# Altium schematic sheet [1.1]MOC_Channel.SchDoc
size A4
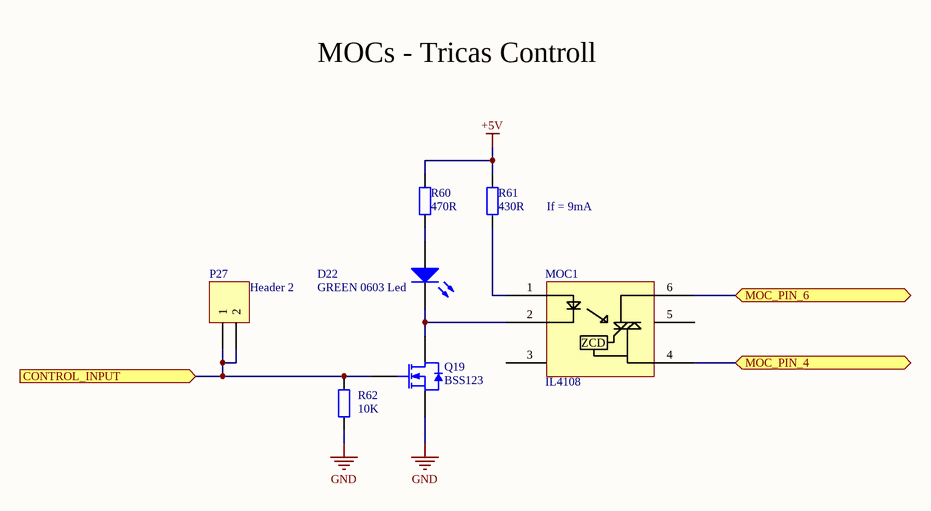
[diagram p0: [1.1]MOC_Channel.SchDoc]

## Parts
D22  GREEN 0603 Led  [LED0603]
MOC1  IL4108  [DIP-6]
P27  Header 2  [HDR1X2]
Q19  BSS123  [SOT23_N]
R60  value 470R  [J1-0603]  (hidden comment: 0603)
R61  value 430R  [J1-0603]  (hidden comment: 0603)
R62  value 10K  [J1-0603]  (hidden comment: 0603)

## Ports
CONTROL_INPUT (in), MOC_PIN_4 (bidir), MOC_PIN_6 (bidir)

## Nets
+5V: R60.2 R61.2
GND: Q19.2(S) R62.1
CONTROL_INPUT: P27.1 P27.2 Q19.1(G) R62.2 ; port CONTROL_INPUT
MOC_PIN_4: MOC1.4(E) ; port MOC_PIN_4
MOC_PIN_6: MOC1.6(B) ; port MOC_PIN_6
NetD22_1: D22.1(A) R60.1
NetD22_2: D22.2(K) MOC1.2(C) Q19.3(D)
NetMOC1_1: MOC1.1(A) R61.1

Not connected (* = marked no-connect by the designer): MOC1 3(NC) 5(C)

## Notes on the sheet
- MOCs - Tricas Controll
- If = 9mA
- (in symbol MOC306x) ZCD

## Library data of the parts
D22 = LED0: Typical INFRARED GaAs LED; Manufacturer Name: KINGBRIGHT; Manufacturer Part No.: KPT-1608CGCK; Note: We have them in Bulgaria; Published: 8-Jun-2000; LatestRevisionDate: 08-Jul-2005; LatestRevisionNote: Mech Layer 1 removed.; PackageReference: LED-0; Publisher: Altium Limited; PackageDescription: LED; 2 Leads; Distributor Link: http://uk.farnell.com/kingbright/kpt-1608cgck/led-green-0603-smd/dp/2099220; Price (per 100 in GBP): 0.09
MOC1 = MOC306x: Optoisolators Trica Driver Output, With Zero Cross Detect; Manufacturer Name: Vishay Semiconductors; Note: Get 10 More; Distributor Link: https://eu.mouser.com/ProductDetail/Vishay-Semiconductors/IL4108?qs=xCMk%252BIHWTZOVWW5ZD8NmWQ==; Manufacturer Part No.: IL4108
P27 = Header 2: Header, 2-Pin; LatestRevisionDate: 17-Jul-2002; LatestRevisionNote: Re-released for DXP Platform.; Publisher: Altium Limited
Q19 = BSS123: N-channel Enhancement Mode Vertical D-MOSFET; Manufacturer Name: ON Semiconductor; Note: We have them in Bulgaria; Published: 17-Sep-2003; LatestRevisionDate: 12-Dec-2006; LatestRevisionNote: IPC-7351 Footprint Added.; DatasheetVersion: Apr-1995; PackageVersion: May-1999; PackageReference: SOT23; Publisher: Altium Limited; PackageDescription: 3-Pin SOT-23 Package 0.95 mm Pitch, 2.3 mm Lead Span; ComponentLink1Description: Manufacturer Link; ComponentLink1URL: http://www.semiconductors.philips.com/; ComponentLink2Description: Datasheet; ComponentLink2URL: http://www.semiconductors.philips.com/acrobat/datasheets/BSS123_3.pdf; Distributor Link: https://eu.mouser.com/ProductDetail/ON-Semiconductor/BSS123LT1G?qs=sGAEpiMZZMshyDBzk1%2fWizSW%252bwlCH%2fhMYWCTWBfWgg8%3d; Manufacturer Part No.: BSS123
R60-R62 = Res2: Resistor; Note: We have them in Bulgaria; Published: 8-Jun-2000; LatestRevisionDate: 17-Jul-2002; LatestRevisionNote: Re-released for DXP Platform.; PackageReference: AXIAL-0.4; Publisher: Altium Limited; PackageDescription: Axial Device, Thru-Hole; 2 Leads; 0.4 in Pin Spacing; Case Code (in): 0603
  R60: Distributor Link: https://uk.farnell.com/vishay/crcw0603470rfkea/res-470r-1-0-1w-0603-thick-film/dp/1469815RL
  R61: Distributor Link: https://uk.farnell.com/vishay/crcw0603430rfkea/res-430r-1-0-1w-0603-thick-film/dp/2141340
  R62: Distributor Link: http://uk.farnell.com/multicomp/mcwr06x1002ftl/res-thick-film-10k-1-0-1w-0603/dp/2447230